# EAGLE design ShieldLed (EAGLE 7.5.0)
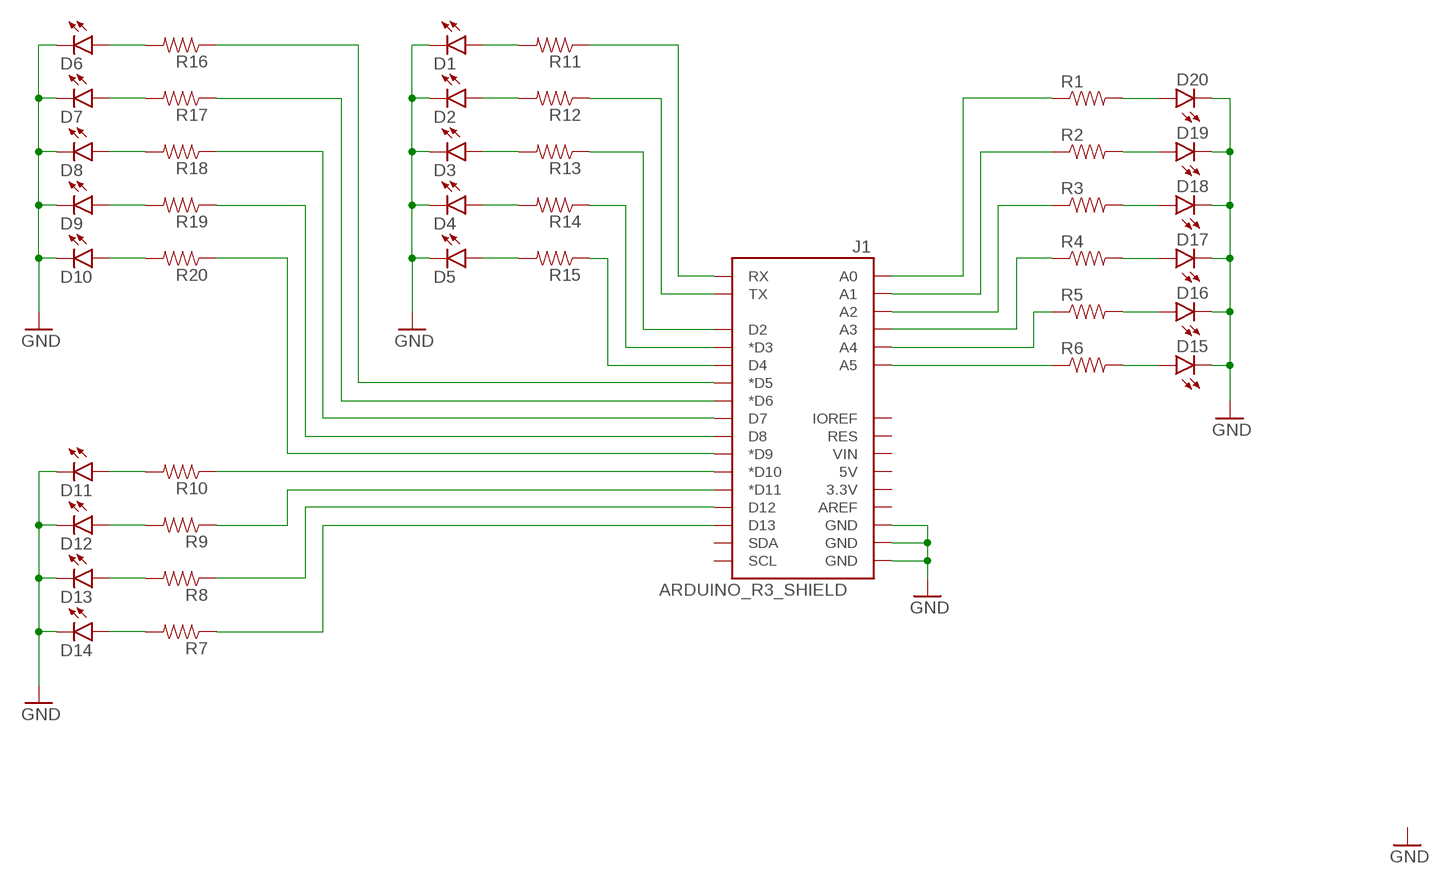
[diagram p0: schematic, sheet 1]

## Parts
D1  LED1206  [LED-1206]
D2  LED1206  [LED-1206]
D3  LED1206  [LED-1206]
D4  LED1206  [LED-1206]
D5  LED1206  [LED-1206]
D6  LED1206  [LED-1206]
D7  LED1206  [LED-1206]
D8  LED1206  [LED-1206]
D9  LED1206  [LED-1206]
D10  LED1206  [LED-1206]
D11  LED1206  [LED-1206]
D12  LED1206  [LED-1206]
D13  LED1206  [LED-1206]
D14  LED1206  [LED-1206]
D15  LED1206  [LED-1206]
D16  LED1206  [LED-1206]
D17  LED1206  [LED-1206]
D18  LED1206  [LED-1206]
D19  LED1206  [LED-1206]
D20  LED1206  [LED-1206]
J1  ARDUINO_R3_SHIELD  [UNO_R3_SHIELD]
R1  RESISTOR1206  [1206]
R2  RESISTOR1206  [1206]
R3  RESISTOR1206  [1206]
R4  RESISTOR1206  [1206]
R5  RESISTOR1206  [1206]
R6  RESISTOR1206  [1206]
R7  RESISTOR1206  [1206]
R8  RESISTOR1206  [1206]
R9  RESISTOR1206  [1206]
R10  RESISTOR1206  [1206]
R11  RESISTOR1206  [1206]
R12  RESISTOR1206  [1206]
R13  RESISTOR1206  [1206]
R14  RESISTOR1206  [1206]
R15  RESISTOR1206  [1206]
R16  RESISTOR1206  [1206]
R17  RESISTOR1206  [1206]
R18  RESISTOR1206  [1206]
R19  RESISTOR1206  [1206]
R20  RESISTOR1206  [1206]

## Nets
GND: D1.C D2.C D3.C D4.C D5.C D6.C D7.C D8.C D9.C D10.C D11.C D12.C D13.C D14.C D15.C D16.C D17.C D18.C D19.C D20.C J1.GND@0(GND) J1.GND@1(GND) J1.GND@2(GND)
N$1: D10.A R20.2
N$2: D9.A R19.2
N$3: D8.A R18.2
N$4: D7.A R17.2
N$5: D6.A R16.2
N$6: D5.A R15.2
N$7: D4.A R14.2
N$8: D3.A R13.2
N$9: D2.A R12.2
N$10: D1.A R11.2
N$11: D11.A R10.2
N$12: D12.A R9.2
N$13: D13.A R8.2
N$14: D14.A R7.2
N$15: D15.A R6.2
N$16: D16.A R5.2
N$17: D17.A R4.2
N$18: D18.A R3.2
N$19: D19.A R2.2
N$20: D20.A R1.2
N$21: J1.D10(*D10) R10.1
N$22: J1.D11(*D11) R9.1
N$23: J1.RX R11.1
N$24: J1.TX R12.1
N$25: J1.D2 R13.1
N$26: J1.D3(*D3) R14.1
N$27: J1.D4 R15.1
N$28: J1.D5(*D5) R16.1
N$29: J1.D6(*D6) R17.1
N$30: J1.D7 R18.1
N$31: J1.D8 R19.1
N$32: J1.D9(*D9) R20.1
N$34: J1.D12 R8.1
N$35: J1.D13 R7.1
N$36: J1.A5 R6.1
N$37: J1.A4 R5.1
N$38: J1.A3 R4.1
N$39: J1.A2 R3.1
N$40: J1.A1 R2.1
N$41: J1.A0 R1.1
Unconnected: J1.3.3V J1.5V J1.AREF J1.IOREF J1.RES J1.SCL J1.SDA J1.VIN

## Library data of the parts
D1-D20 = SparkFun-LED:LED: LEDs Standard schematic elements and footprints for 5mm, 3mm, 1206, and 0603 sized LEDs. 5mm - Spark Fun Electronics SKU : COM-00529 (and others)
J1 = SparkFun-Boards:ARDUINO_R3_SHIELD: Shield form compatible with the Arduino Uno R3.
R1-R20 = SparkFun-Passives:RESISTOR: Resistor Basic schematic elements and footprints for 0603, 1206, and PTH resistors.

## Board
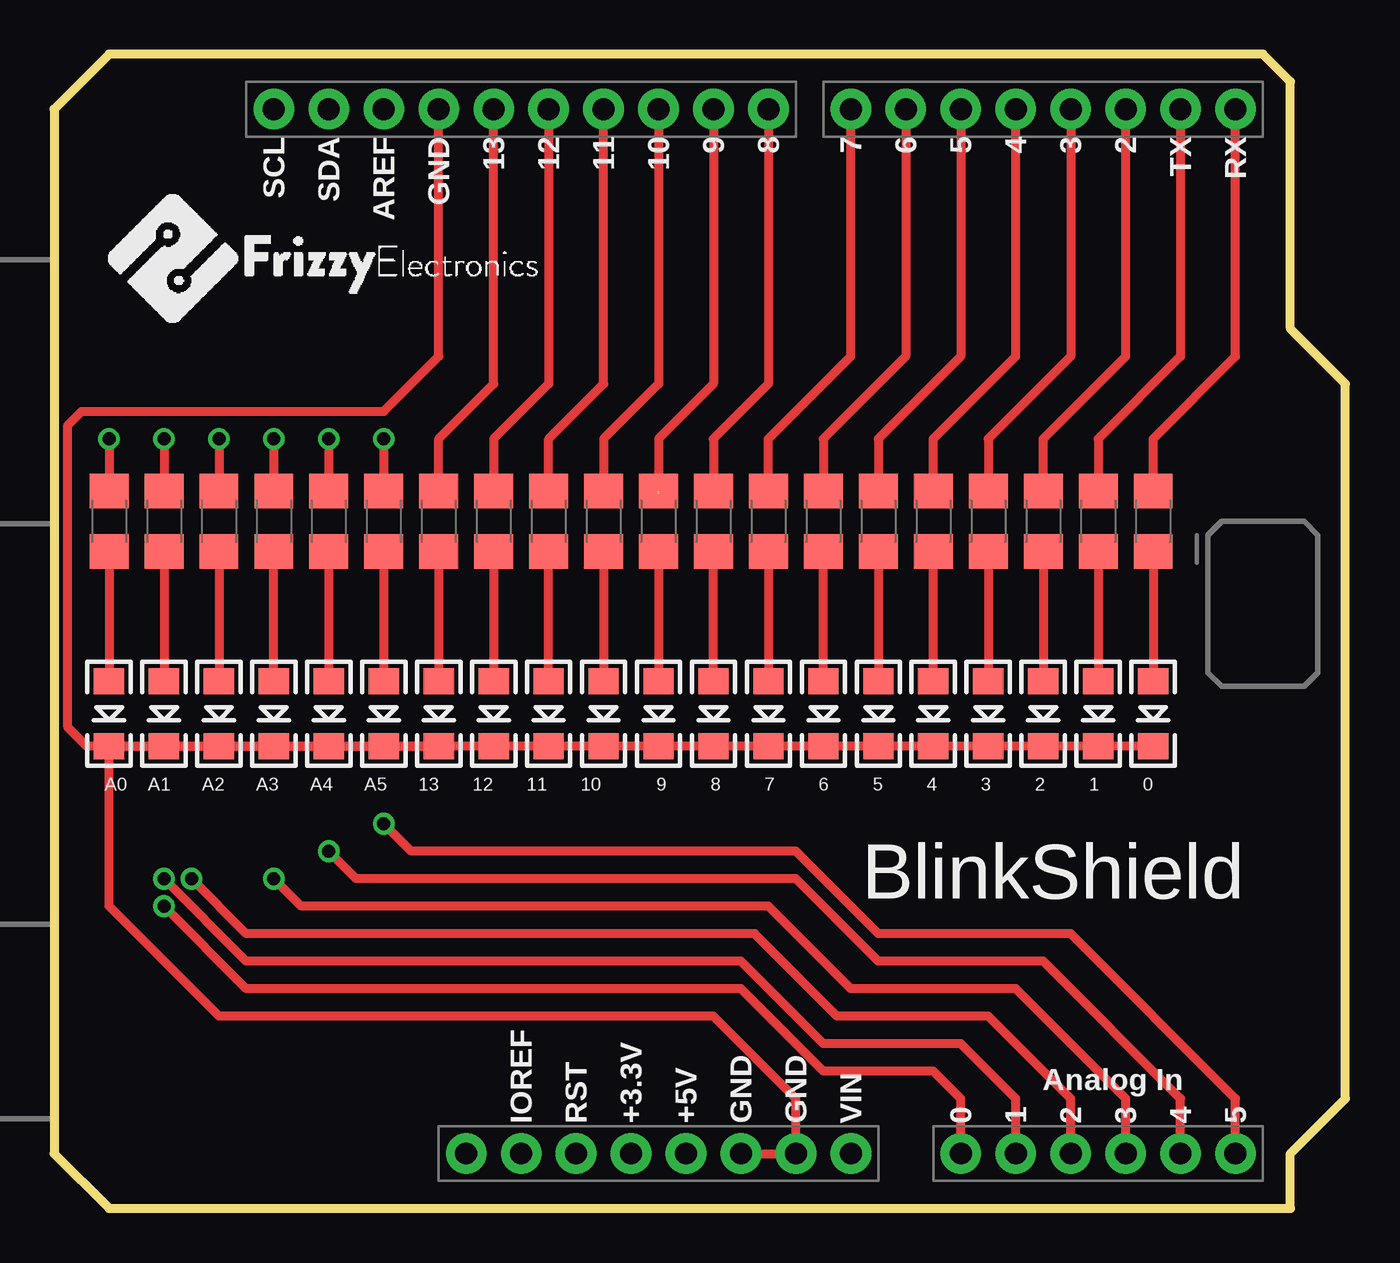
[diagram p1: board, top side]
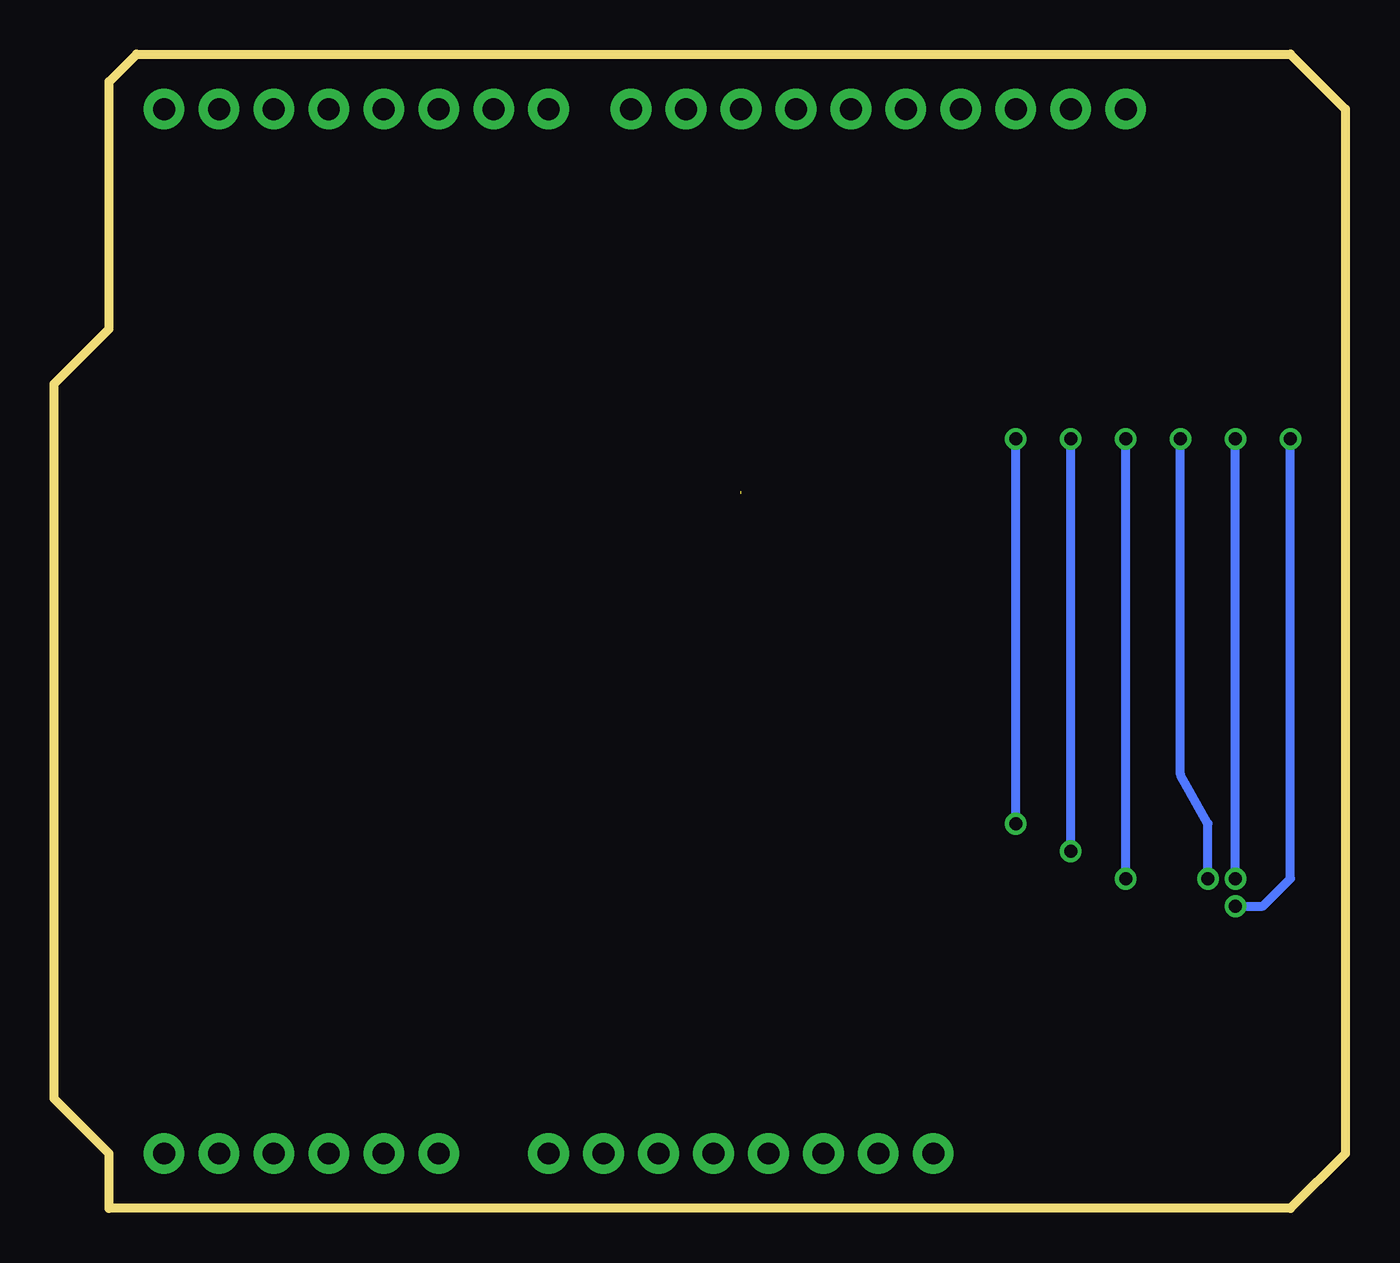
[diagram p2: board, bottom side, seen from below]

Size 59.69 x 53.34 mm. Coordinates in mm from the lower left corner, seen from the top.
Outline: 0,50.8 0,2.54 2.54,0 57.15,0 57.15,2.54 59.69,5.08 59.69,38.1 57.15,40.64 57.15,52.07 55.88,53.34 2.54,53.34 0,50.8
Copper layers (1*16): Top 0.035mm / dielectric 1.5mm / Bottom 0.035mm
Design rules "default": minimum track width 10mil, minimum drill 24mil, track to track 8mil, track to pad 8mil, pad to pad 8mil, via to via 8mil, smd to smd 8mil, copper to edge 40mil, drill to drill 8mil, minimum pad ring 10mil, minimum via ring 8mil, stop-mask expansion 4mil, vias tented up to drill 0mil, thermal gap 10mil

### Footprints (pad centres in the part's own frame; a part is rotated, then mirrored left to right if it is on the bottom)
LED-1206 = smd 1.2 x 1.4: A -1.5,0; C 1.5,0
UNO_R3_SHIELD = drill 1.016 pad 1.88: 3.3V 50.8,26.67; 5V 50.8,29.21; A0 50.8,41.91; A1 50.8,44.45; A2 50.8,46.99; A3 50.8,49.53; A4 50.8,52.07; A5 50.8,54.61; AREF 2.54,15.24; D2 2.54,49.53; D3 2.54,46.99; D4 2.54,44.45; D5 2.54,41.91; D6 2.54,39.37; D7 2.54,36.83; D8 2.54,33.02; D9 2.54,30.48; D10 2.54,27.94; D11 2.54,25.4; D12 2.54,22.86; D13 2.54,20.32; GND@0 50.8,31.75; GND@1 50.8,34.29; GND@2 2.54,17.78; IOREF 50.8,21.59; NC 50.8,19.05; RES 50.8,24.13; RX 2.54,54.61; SCL 2.54,10.16; SDA 2.54,12.7; TX 2.54,52.07; VIN 50.8,36.83
1206 = smd 1.6 x 1.8: 1 -1.4,0; 2 1.4,0

### Placement (x,y rotation side)
D1  50.8,22.86 270 top
D2  48.26,22.86 270 top
D3  45.72,22.86 270 top
D4  43.18,22.86 270 top
D5  40.64,22.86 270 top
D6  38.1,22.86 270 top
D7  35.56,22.86 270 top
D8  33.02,22.86 270 top
D9  30.48,22.86 270 top
D10  27.94,22.86 270 top
D11  25.4,22.86 270 top
D12  22.86,22.86 270 top
D13  20.32,22.86 270 top
D14  17.78,22.86 270 top
D15  15.24,22.86 270 top
D16  12.7,22.86 270 top
D17  10.16,22.86 270 top
D18  7.62,22.86 270 top
D19  5.08,22.86 270 top
D20  2.54,22.86 270 top
J1  0,53.34 270 top
R1  2.54,31.75 270 top
R2  5.08,31.75 270 top
R3  7.62,31.75 270 top
R4  10.16,31.75 270 top
R5  12.7,31.75 270 top
R6  15.24,31.75 270 top
R7  17.78,31.75 270 top
R8  20.32,31.75 270 top
R9  22.86,31.75 270 top
R10  25.4,31.75 270 top
R11  50.8,31.75 270 top
R12  48.26,31.75 270 top
R13  45.72,31.75 270 top
R14  43.18,31.75 270 top
R15  40.64,31.75 270 top
R16  38.1,31.75 270 top
R17  35.56,31.75 270 top
R18  33.02,31.75 270 top
R19  30.48,31.75 270 top
R20  27.94,31.75 270 top

### Tracks (layer width: path | path; a pad name or v marks a point on that pad's centre or on a via)
GND
  Top 0.406: D20.C D19.C | D20.C D18.C D17.C D16.C D15.C D14.C | D1.C D2.C D3.C D4.C D5.C D6.C D7.C D8.C D9.C D10.C D11.C D12.C D13.C D14.C | J1.GND@0 J1.GND@1 34.29,5.08 30.48,8.89 7.62,8.89 2.54,13.97 D20.C | D14.C 1.5,21.36 0.63,22.22 0.63,36.2 1.27,36.83 15.24,36.83 17.78,39.37 J1.GND@2
N$1
  Top 0.406: R20.2 D10.A 27.94,24.13
N$2
  Top 0.406: D9.A R19.2
N$3
  Top 0.406: R18.2 D8.A
N$4
  Top 0.406: D7.A R17.2
N$5
  Top 0.406: R16.2 D6.A
N$6
  Top 0.406: D5.A R15.2
N$7
  Top 0.406: R14.2 D4.A
N$8
  Top 0.406: R13.2 D3.A
N$9
  Top 0.406: R12.2 D2.A
N$10
  Top 0.406: R11.2 D1.A
N$11
  Top 0.406: R10.2 D11.A
N$12
  Top 0.406: D12.A R9.2
N$13
  Top 0.406: R8.2 D13.A
N$14
  Top 0.406: R7.2 D14.A
N$15
  Top 0.406: R6.2 D15.A
N$16
  Top 0.406: R5.2 D16.A
N$17
  Top 0.406: D17.A R4.2
N$18
  Top 0.406: R3.2 D18.A
N$19
  Top 0.406: R2.2 D19.A
N$20
  Top 0.406: R1.2 D20.A
N$21
  Top 0.406: J1.D10 27.94,38.1 25.4,35.56 R10.1
N$22
  Top 0.406: R9.1 22.86,35.56 25.4,38.1 J1.D11
N$23
  Top 0.406: R11.1 50.8,35.56 54.61,39.37 J1.RX
N$24
  Top 0.406: J1.TX 52.07,39.37 48.26,35.56 R12.1
N$25
  Top 0.406: R13.1 45.72,35.56 49.53,39.37 J1.D2
N$26
  Top 0.406: J1.D3 46.99,39.37 43.18,35.56 R14.1
N$27
  Top 0.406: R15.1 40.64,35.56 44.45,39.37 J1.D4
N$28
  Top 0.406: J1.D5 41.91,39.37 38.1,35.56 R16.1
N$29
  Top 0.406: J1.D6 39.37,39.37 35.56,35.56 R17.1
N$30
  Top 0.406: R18.1 33.02,35.56 36.83,39.37 J1.D7
N$31
  Top 0.406: J1.D8 33.02,38.1 30.48,35.56 R19.1
N$32  (1 unrouted)
  Top 0.406: J1.D9 30.48,38.1 27.94,35.56 27.94,33.02
N$34
  Top 0.406: J1.D12 22.86,38.1 20.32,35.56 R8.1
N$35
  Top 0.406: R7.1 17.78,35.56 20.32,38.1 J1.D13
N$36  (via drill 0.6)
  Top 0.406: J1.A5 54.61,5.08 46.99,12.7 38.1,12.7 34.29,16.51 16.51,16.51 v15.24,17.78 | v15.24,35.56 R6.1
  Bottom 0.406: v15.24,17.78 v15.24,35.56
N$37  (via drill 0.6)
  Top 0.406: J1.A4 52.07,5.08 45.72,11.43 38.1,11.43 34.29,15.24 13.97,15.24 v12.7,16.51 | v12.7,35.56 R5.1
  Bottom 0.406: v12.7,16.51 v12.7,35.56
N$38  (via drill 0.6)
  Top 0.406: J1.A3 49.53,5.08 44.45,10.16 36.83,10.16 33.02,13.97 11.43,13.97 v10.16,15.24 | v10.16,35.56 R4.1
  Bottom 0.406: v10.16,15.24 v10.16,35.56
N$39  (via drill 0.6)
  Top 0.406: J1.A2 46.99,5.08 43.18,8.89 36.2,8.89 32.38,12.7 8.89,12.7 v6.35,15.24 | v7.62,35.56 R3.1 7.62,33.02
  Bottom 0.406: v6.35,15.24 6.35,17.78 7.62,20.05 v7.62,35.56
N$40  (via drill 0.6)
  Top 0.406: J1.A1 44.45,5.08 41.91,7.62 35.56,7.62 31.75,11.43 8.89,11.43 v5.08,15.24 | v5.08,35.56 R2.1
  Bottom 0.406: v5.08,15.24 v5.08,35.56
N$41  (via drill 0.6)
  Top 0.406: J1.A0 41.91,5.08 40.64,6.35 35.56,6.35 31.75,10.16 8.89,10.16 v5.08,13.97 | v2.54,35.56 R1.1
  Bottom 0.406: v5.08,13.97 3.81,13.97 2.54,15.24 v2.54,35.56

### Text on the board
tNames: A0 | A1 | A2 | A3 | A4 | A5 | 13 | 12 | 11 | 10 | 9 | 8 | 7 | 6 | 5 | 4 | 3 | 2 | 1 | 0 | BlinkShield